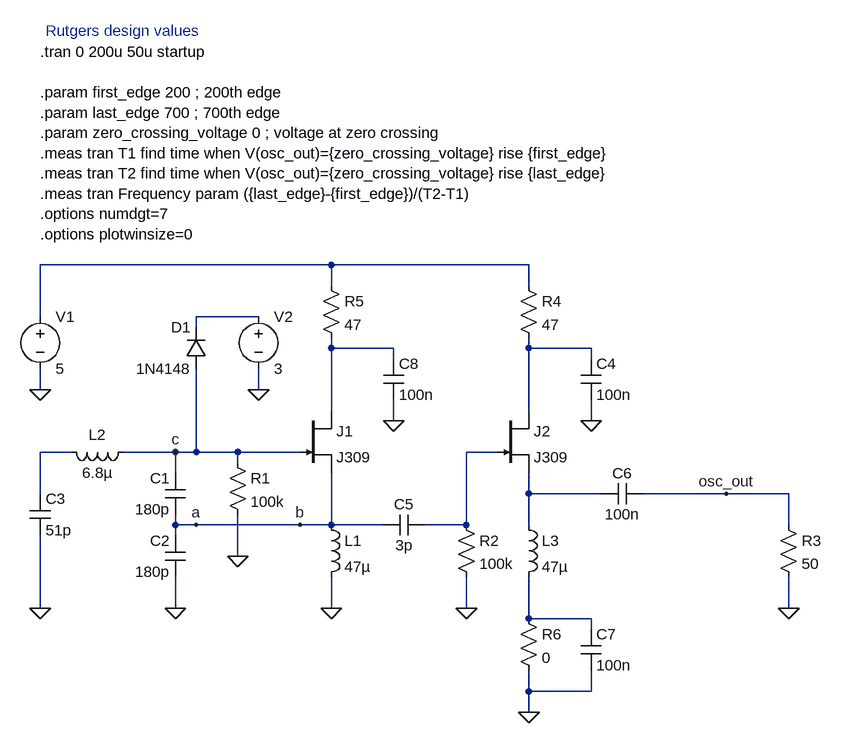
[diagram p0: schematic sim1.asc]
sim1.asc, the LTspice schematic file:
Version 4.1
SHEET 1 936 708
WIRE 176 0 -272 0
WIRE 480 0 176 0
WIRE 176 32 176 0
WIRE 480 32 480 0
WIRE -272 80 -272 0
WIRE 64 80 -32 80
WIRE -32 96 -32 80
WIRE 176 128 176 112
WIRE 272 128 176 128
WIRE 480 128 480 112
WIRE 576 128 480 128
WIRE 272 144 272 128
WIRE 576 144 576 128
WIRE -272 192 -272 160
WIRE 64 192 64 160
WIRE 176 224 176 128
WIRE 480 224 480 128
WIRE 272 240 272 208
WIRE 576 240 576 208
WIRE -224 288 -272 288
WIRE -64 288 -144 288
WIRE -32 288 -32 160
WIRE -32 288 -64 288
WIRE 32 288 -32 288
WIRE 128 288 32 288
WIRE 432 288 384 288
WIRE 32 304 32 288
WIRE -64 320 -64 288
WIRE -272 352 -272 288
WIRE 480 352 480 320
WIRE 592 352 480 352
WIRE 784 352 656 352
WIRE 880 352 784 352
WIRE -64 400 -64 384
WIRE -32 400 -64 400
WIRE 128 400 -32 400
WIRE 176 400 176 320
WIRE 176 400 128 400
WIRE 256 400 176 400
WIRE 384 400 384 288
WIRE 384 400 320 400
WIRE 480 400 480 352
WIRE 880 400 880 352
WIRE -64 416 -64 400
WIRE 32 448 32 384
WIRE -272 528 -272 416
WIRE -64 528 -64 480
WIRE 176 528 176 480
WIRE 384 528 384 480
WIRE 880 528 880 480
WIRE 480 544 480 480
WIRE 576 544 480 544
WIRE 576 560 576 544
WIRE 480 656 480 624
WIRE 576 656 576 624
WIRE 576 656 480 656
WIRE 480 688 480 656
FLAG -272 192 0
FLAG -272 528 0
FLAG -64 528 0
FLAG 176 528 0
FLAG 384 528 0
FLAG 480 688 0
FLAG 880 528 0
FLAG 784 352 osc_out
FLAG 64 192 0
FLAG -32 400 a
FLAG 128 400 b
FLAG -64 288 c
FLAG 576 240 0
FLAG 272 240 0
FLAG 32 448 0
DATAFLAG 0 288 ""
SYMBOL njf 128 224 R0
SYMATTR InstName J1
SYMATTR Value J309
SYMBOL ind 160 384 R0
SYMATTR InstName L1
SYMATTR Value 47µ
SYMATTR SpiceLine Rser=1m
SYMBOL res 16 288 R0
SYMATTR InstName R1
SYMATTR Value 100k
SYMBOL cap -48 384 R180
WINDOW 0 24 56 Left 2
WINDOW 3 24 8 Left 2
SYMATTR InstName C1
SYMATTR Value 180p
SYMBOL cap -48 480 R180
WINDOW 0 24 56 Left 2
WINDOW 3 24 8 Left 2
SYMATTR InstName C2
SYMATTR Value 180p
SYMBOL cap -288 352 R0
SYMATTR InstName C3
SYMATTR Value 51p
SYMATTR SpiceLine Rpar=1meg
SYMBOL ind -128 272 R90
WINDOW 0 5 56 VBottom 2
WINDOW 3 32 56 VTop 2
SYMATTR InstName L2
SYMATTR Value 6.8µ
SYMBOL voltage -272 64 R0
WINDOW 123 0 0 Left 0
WINDOW 39 0 0 Left 0
SYMATTR InstName V1
SYMATTR Value 5
SYMBOL diode -16 160 R180
WINDOW 0 24 64 Left 2
WINDOW 3 24 0 Left 2
SYMATTR InstName D1
SYMATTR Value 1N4148
SYMBOL njf 432 224 R0
SYMATTR InstName J2
SYMATTR Value J309
SYMBOL res 368 384 R0
SYMATTR InstName R2
SYMATTR Value 100k
SYMBOL ind 464 384 R0
SYMATTR InstName L3
SYMATTR Value 47µ
SYMATTR SpiceLine Rser=1m
SYMBOL res 864 384 R0
SYMATTR InstName R3
SYMATTR Value 50
SYMBOL cap 656 336 R90
WINDOW 0 0 32 VBottom 2
WINDOW 3 32 32 VTop 2
SYMATTR InstName C6
SYMATTR Value 100n
SYMBOL cap 320 384 R90
WINDOW 0 0 32 VBottom 2
WINDOW 3 32 32 VTop 2
SYMATTR InstName C5
SYMATTR Value 3p
SYMBOL voltage 64 64 R0
WINDOW 123 0 0 Left 0
WINDOW 39 0 0 Left 0
SYMATTR InstName V2
SYMATTR Value 3
SYMBOL res 464 16 R0
SYMATTR InstName R4
SYMATTR Value 47
SYMBOL cap 560 144 R0
SYMATTR InstName C4
SYMATTR Value 100n
SYMBOL res 160 16 R0
SYMATTR InstName R5
SYMATTR Value 47
SYMBOL cap 256 144 R0
SYMATTR InstName C8
SYMATTR Value 100n
SYMBOL res 464 528 R0
SYMATTR InstName R6
SYMATTR Value 0
SYMBOL cap 560 560 R0
SYMATTR InstName C7
SYMATTR Value 100n
TEXT -272 -328 Left 2 !.tran 0 200u 50u startup\n \n.param first_edge 200 ; 200th edge\n.param last_edge 700 ; 700th edge\n.param zero_crossing_voltage 0 ; voltage at zero crossing\n.meas tran T1 find time when V(osc_out)={zero_crossing_voltage} rise {first_edge}\n.meas tran T2 find time when V(osc_out)={zero_crossing_voltage} rise {last_edge}\n.meas tran Frequency param ({last_edge}-{first_edge})/(T2-T1)\n.options numdgt=7\n.options plotwinsize=0
TEXT -264 -360 Left 2 ;Rutgers design values

The netlist it stands for:
* sim1.asc
J1 N003 c b J309
L1 b 0 47µ Rser=1m
R1 c 0 100k
C1 b c 180p
C2 0 b 180p
C3 N005 0 51p Rpar=1meg
L2 c N005 6.8µ
V1 N001 0 5
D1 c N002 1N4148
J2 N004 N006 N007 J309
R2 N006 0 100k
L3 N007 N008 47µ Rser=1m
R3 osc_out 0 50
C6 osc_out N007 100n
C5 N006 b 3p
V2 N002 0 3
R4 N001 N004 47
C4 N004 0 100n
R5 N001 N003 47
C8 N003 0 100n
R6 N008 0 0
C7 N008 0 100n
.model D D
.lib standard.dio
.model NJF NJF
.model PJF PJF
.lib standard.jft
.tran 0 200u 50u startup
.param first_edge 200 ; 200th edge
.param last_edge 700 ; 700th edge
.param zero_crossing_voltage 0 ; voltage at zero crossing
.meas tran T1 find time when V(osc_out)={zero_crossing_voltage} rise {first_edge}
.meas tran T2 find time when V(osc_out)={zero_crossing_voltage} rise {last_edge}
.meas tran Frequency param ({last_edge}-{first_edge})/(T2-T1)
.options numdgt=7
.options plotwinsize=0
* Rutgers design values
.backanno
.end